# Altium schematic sheet input_vhall.SchDoc
size A3; Organization: Altium Limited; Address1: L3, 12a Rodborough Rd; Address2: Frenchs Forest; Address3: NSW; Address4: Australia 2086
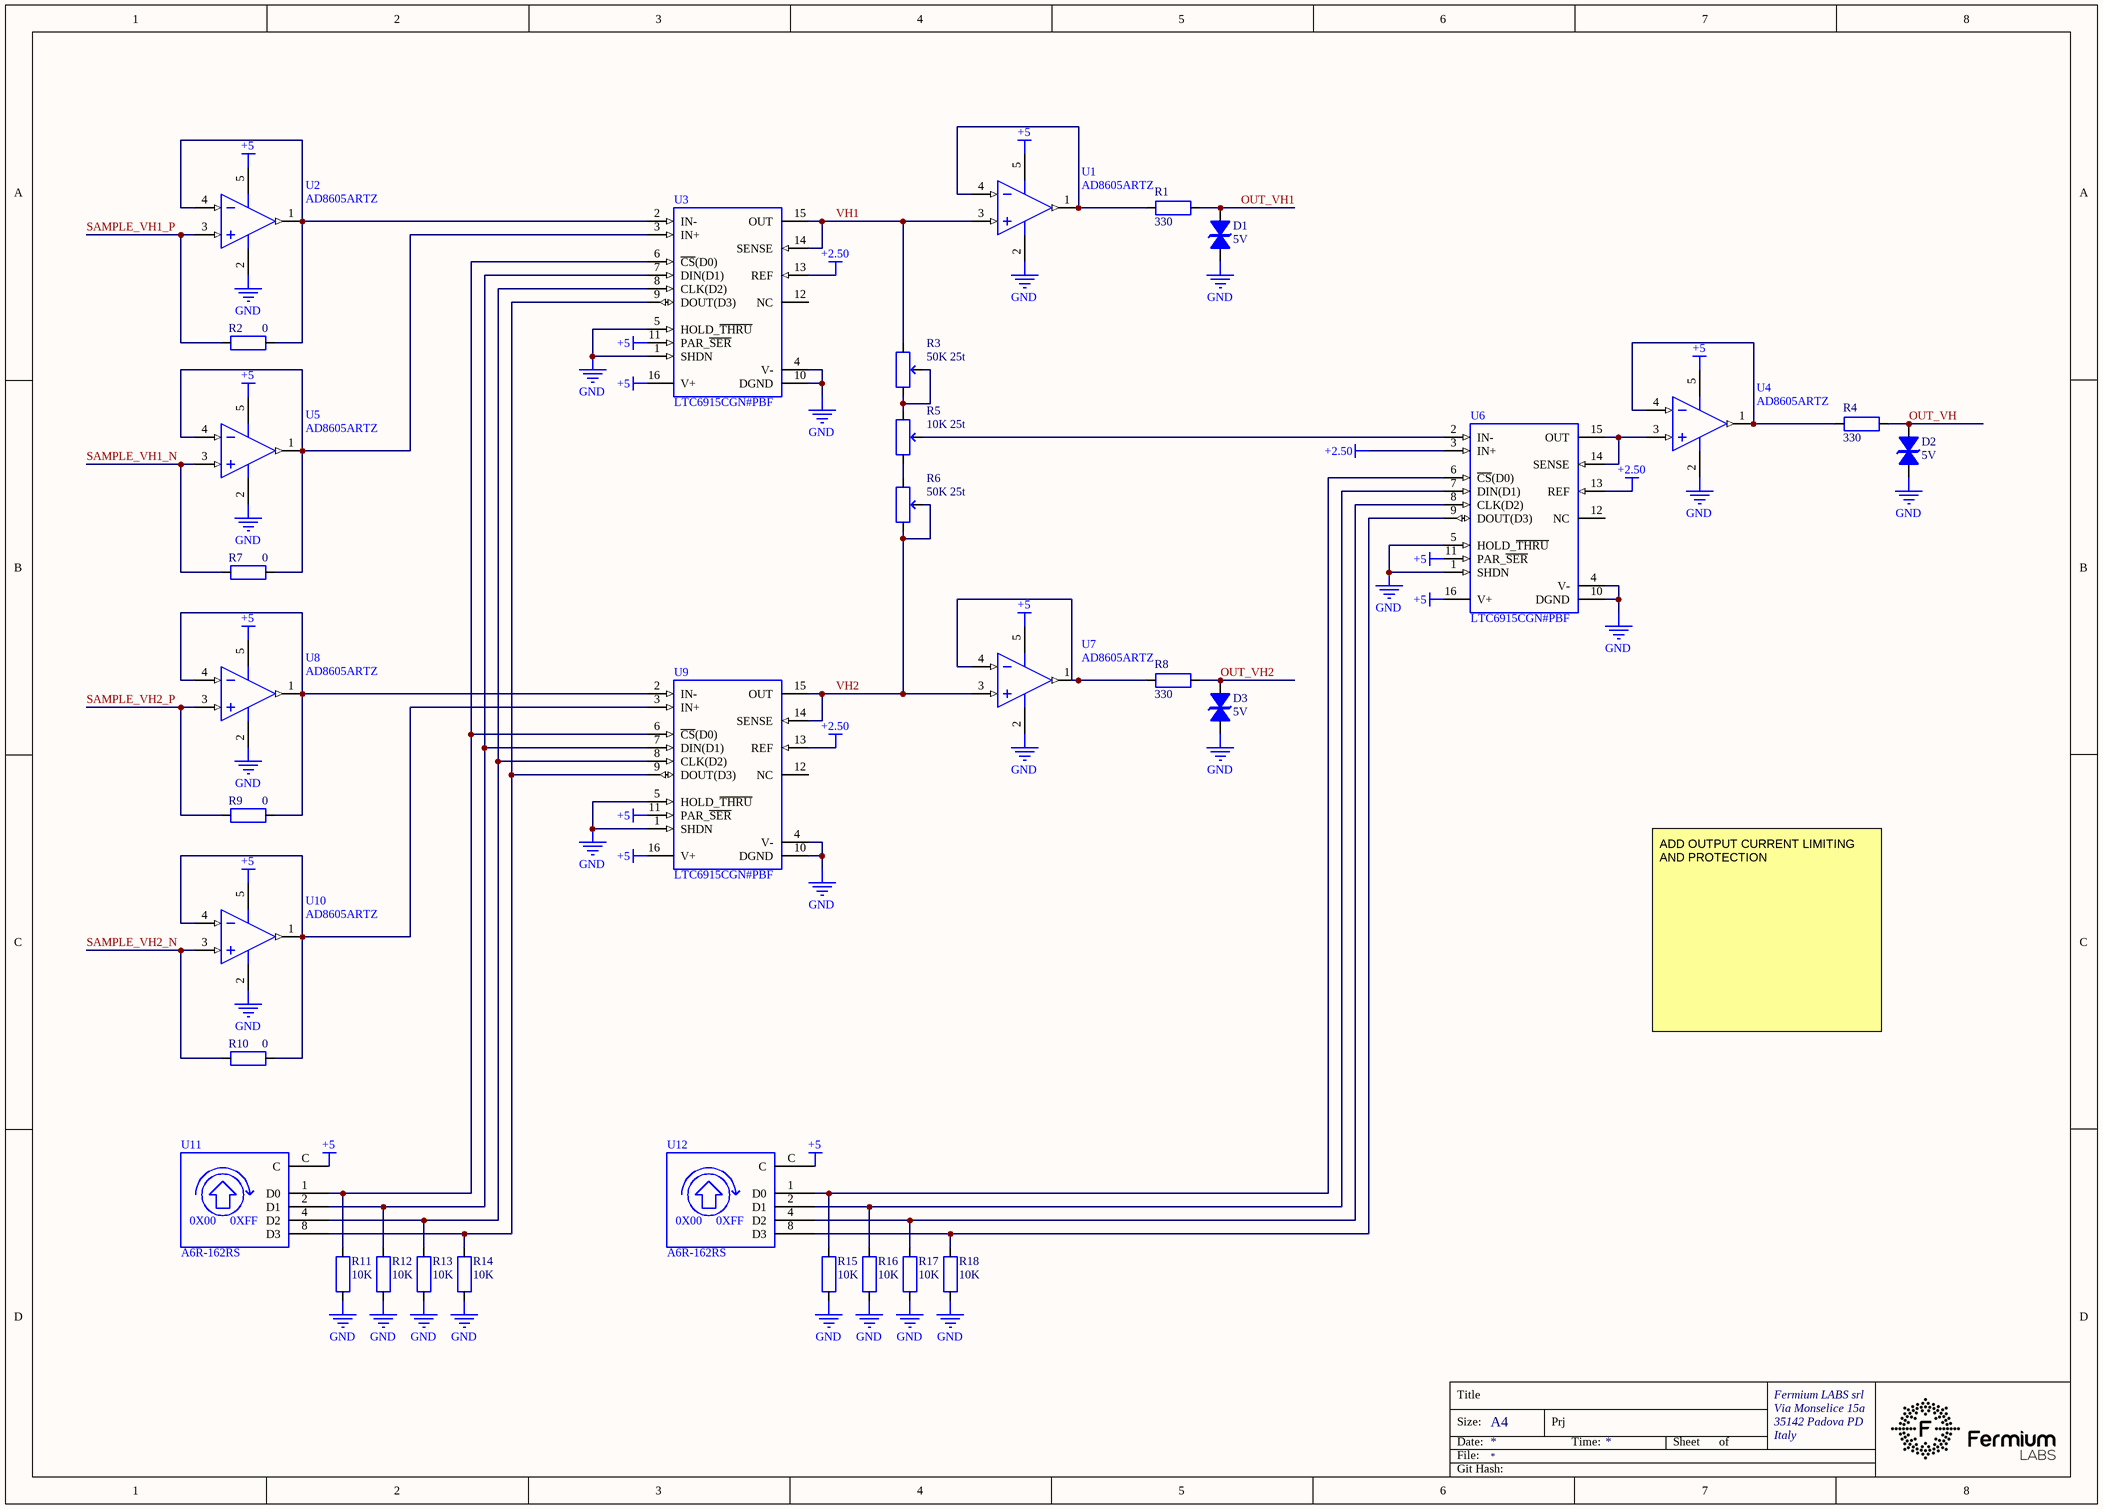
[diagram p0: input_vhall.SchDoc]

## Parts
D1  5V  [SOD523F]
D2  5V  [SOD523F]
D3  5V  [SOD523F]
R1  330
R2  0  [RES 0603_1608]
R3  50K 25t  [F9540903-09ED-4909-856A-DED10E64451E]
R4  330
R5  10K 25t  [F9540903-09ED-4909-856A-DED10E64451E]
R6  50K 25t  [F9540903-09ED-4909-856A-DED10E64451E]
R7  0  [RES 0603_1608]
R8  330
R9  0  [RES 0603_1608]
R10  0  [RES 0603_1608]
R11  10K  [RES 0603_1608]
R12  10K  [RES 0603_1608]
R13  10K  [RES 0603_1608]
R14  10K  [RES 0603_1608]
R15  10K  [RES 0603_1608]
R16  10K  [RES 0603_1608]
R17  10K  [RES 0603_1608]
R18  10K  [RES 0603_1608]
U1  AD8605ARTZ  [A3DDA0BC-073E-4B18-9613-F713A7EC1E27]
U2  AD8605ARTZ  [A3DDA0BC-073E-4B18-9613-F713A7EC1E27]
U3  LTC6915CGN#PBF  [517EE8A2-9FD8-4174-996D-BDBF76CA3EEB]
U4  AD8605ARTZ  [A3DDA0BC-073E-4B18-9613-F713A7EC1E27]
U5  AD8605ARTZ  [A3DDA0BC-073E-4B18-9613-F713A7EC1E27]
U6  LTC6915CGN#PBF  [517EE8A2-9FD8-4174-996D-BDBF76CA3EEB]
U7  AD8605ARTZ  [A3DDA0BC-073E-4B18-9613-F713A7EC1E27]
U8  AD8605ARTZ  [A3DDA0BC-073E-4B18-9613-F713A7EC1E27]
U9  LTC6915CGN#PBF  [517EE8A2-9FD8-4174-996D-BDBF76CA3EEB]
U10  AD8605ARTZ  [A3DDA0BC-073E-4B18-9613-F713A7EC1E27]
U11  A6R-162RS  [2599C238-5645-4A8C-8BF9-C7515FACCFA0]
U12  A6R-162RS  [2599C238-5645-4A8C-8BF9-C7515FACCFA0]

## Nets
+2.50: U3.13(REF) U6.3(IN+) U6.13(REF) U9.13(REF)
+5: U1.5(+V) U2.5(+V) U3.11(PAR_~{SER}) U3.16(V+) U4.5(+V) U5.5(+V) U6.11(PAR_~{SER}) U6.16(V+) U7.5(+V) U8.5(+V) U9.11(PAR_~{SER}) U9.16(V+) U10.5(+V) U11.C U12.C
GND: D1.2 D2.2 D3.2 R11.1 R12.1 R13.1 R14.1 R15.1 R16.1 R17.1 R18.1 U1.2(-V) U2.2(-V) U3.1(SHDN) U3.4(V-) U3.5(HOLD_~{THRU}) U3.10(DGND) U4.2(-V) U5.2(-V) U6.1(SHDN) U6.4(V-) U6.5(HOLD_~{THRU}) U6.10(DGND) U7.2(-V) U8.2(-V) U9.1(SHDN) U9.4(V-) U9.5(HOLD_~{THRU}) U9.10(DGND) U10.2(-V)
OUT_VH: D2.1 R4.2
OUT_VH1: D1.1 R1.2
OUT_VH2: D3.1 R8.2
SAMPLE_VH1_N: R7.1 U5.3(+IN)
SAMPLE_VH1_P: R2.1 U2.3(+IN)
SAMPLE_VH2_N: R10.1 U10.3(+IN)
SAMPLE_VH2_P: R9.1 U8.3(+IN)
VH1: R3.1 U1.3(+IN) U3.14(SENSE) U3.15(OUT)
VH2: R6.2 R6.3 U7.3(+IN) U9.14(SENSE) U9.15(OUT)
NetR1_1: R1.1 U1.1(OUT) U1.4(-IN)
NetR2_2: R2.2 U2.1(OUT) U2.4(-IN) U3.2(IN-)
NetR3_2: R3.2 R3.3 R5.3
NetR4_1: R4.1 U4.1(OUT) U4.4(-IN)
NetR5_1: R5.1 R6.1
NetR5_2: R5.2 U6.2(IN-)
NetR7_2: R7.2 U3.3(IN+) U5.1(OUT) U5.4(-IN)
NetR8_1: R8.1 U7.1(OUT) U7.4(-IN)
NetR9_2: R9.2 U8.1(OUT) U8.4(-IN) U9.2(IN-)
NetR10_2: R10.2 U9.3(IN+) U10.1(OUT) U10.4(-IN)
NetR11_2: R11.2 U3.6(~{CS}(D0)) U9.6(~{CS}(D0)) U11.1(D0)
NetR12_2: R12.2 U3.7(DIN(D1)) U9.7(DIN(D1)) U11.2(D1)
NetR13_2: R13.2 U3.8(CLK(D2)) U9.8(CLK(D2)) U11.4(D2)
NetR14_2: R14.2 U3.9(DOUT(D3)) U9.9(DOUT(D3)) U11.8(D3)
NetR15_2: R15.2 U6.6(~{CS}(D0)) U12.1(D0)
NetR16_2: R16.2 U6.7(DIN(D1)) U12.2(D1)
NetR17_2: R17.2 U6.8(CLK(D2)) U12.4(D2)
NetR18_2: R18.2 U6.9(DOUT(D3)) U12.8(D3)
NetU4_3: U4.3(+IN) U6.14(SENSE) U6.15(OUT)

Not connected (* = marked no-connect by the designer): U3 12(NC); U6 12(NC); U9 12(NC)

## Notes on the sheet
- ADD OUTPUT CURRENT LIMITING AND PROTECTION
- Title
- Fermium LABS srl
- Size:
- Date:
- File:
- A4
- Prj
- Time:
- Sheet
- of
- Via Monselice 15a
- 35142 Padova PD
- Italy
- Git Hash:
- (in symbol bbf157ad-cd7a-4e82-97e3-d6a037590888) 0X00; 0XFF

## Library data of the parts
D1-D3 = daa58212-38e2-4326-a156-8e48058c46f1: DIODE SMD TVS 5V BIDIRECTIONAL SOD-523; Manufacturer 1: Born Semiconductor; Manufacturer Part Number 1: PESD5V0S1BBN; id: 14837; Part Number: daa58212-38e2-4326-a156-8e48058c46f1; ComponentLink1Description: Datasheet; ComponentLink1URL: http://localhost:8080/static/files/Nexperia-PESD5V0S1BB-115_C976402019-08-16_201905.624024.pdf?Nexperia-PESD5V0S1BB-115_C97640.pdf; ComponentLink2Description: Datasheet; ComponentLink2URL: http://localhost:8080/static/files/1901051701_Bourne-Semicon-Shenzhen-PESD5V0S1BBN_C3142642019-08-16_201911.992552.pdf?1901051701_Bourne-Semicon-Shenzhen-PESD5V0S1BBN_C314264.pdf; Manufacturer 2: Nexperia; Manufacturer Part Number 2: PESD5V0S1BB,115; Value: 5V
R1 R4 R8 = e8555d7b-eeda-4727-b2e1-550cdc03d819: RES SMD 330 OHM 1% 1/10W 0603; Manufacturer 1: Yageo; Manufacturer Part Number 1: RC0603FR-07330RL; id: 12350; Part Number: e8555d7b-eeda-4727-b2e1-550cdc03d819; Value: 330
R2 R7 R9 R10 = 6ae227f9-847f-4766-8522-e11a83531204: RES SMD 0 OHM 5% 1/10W 0603; Manufacturer 1: Yageo; Manufacturer Part Number 1: RC0603JR-070RL; id: 11973; Part Number: 6ae227f9-847f-4766-8522-e11a83531204; Value: 0
R3 R6 = 90164141-8820-4471-9a6f-9a984ce9068c: POT TRIMMER LINEAR 50K 25TURNS VERT THT; Manufacturer 1: Bourns; Manufacturer Part Number 1: 3296W-1-503LF; id: 14849; Part Number: 90164141-8820-4471-9a6f-9a984ce9068c; ComponentLink1Description: Datasheet; ComponentLink1URL: http://localhost:8080/static/files/BOURNS-3296W-1-103LF_C34846_12019-08-17_221926.713297.pdf?BOURNS-3296W-1-103LF_C34846 (1).pdf; Value: 50K 25t
R5 = 613f65ed-4d8d-44d0-9fe5-67eff78392c9: POT TRIMMER LINEAR 10K 25TURNS VERT THT; Manufacturer 1: Bourns; Manufacturer Part Number 1: 3296W-1-103LF; id: 14847; Part Number: 613f65ed-4d8d-44d0-9fe5-67eff78392c9; ComponentLink1Description: 3D Model; ComponentLink1URL: http://localhost:8080/static/files/3296W_v12019-08-17_171307.552870.step?3296W v1.step; ComponentLink2Description: Datasheet; ComponentLink2URL: http://localhost:8080/static/files/BOURNS-3296W-1-103LF_C348462019-08-17_171320.734450.pdf?BOURNS-3296W-1-103LF_C34846.pdf; Value: 10K 25t
R11-R18 = 93242766-ba1d-462d-b58f-ce1dfc4129c8: RES SMD 10K OHM 1% 1/10W 0603; Manufacturer 1: Yageo; Manufacturer Part Number 1: RC0603FR-0710KL; id: 12101; Part Number: 93242766-ba1d-462d-b58f-ce1dfc4129c8; Value: 10K
U1 U2 U4 U5 U7 U8 U10 = 5610e9ea-bca8-49b2-8e5f-11409231f6a4: IC OPAMP 65uV 1pA RRIO 5V 80mA SOT-23-5; Manufacturer 1: Analog Devices; id: 14830; Part Number: 5610e9ea-bca8-49b2-8e5f-11409231f6a4; ComponentLink1Description: Datasheet; ComponentLink1URL: http://localhost:8080/static/files/Analog_Devices-AD8605ARTZ-REEL7-datasheet2019-08-16_175825.352099.pdf?Analog_Devices-AD8605ARTZ-REEL7-datasheet.pdf; Manufacturer Part Number 1: AD8605ARTZ
U3 U6 U9 = 59fe82cd-fd18-4813-9f52-e2e78a460aff: IC PGA G0-4094 SPI-PARALLEL 5V RRIO SSOP-16; Manufacturer 1: Analog Devices; id: 14835; Part Number: 59fe82cd-fd18-4813-9f52-e2e78a460aff; ComponentLink1Description: Datasheet; ComponentLink1URL: http://localhost:8080/static/files/Linear_Technology-LTC6915CDEPBF-datasheet2019-08-16_194420.284095.pdf?Linear_Technology-LTC6915CDE#PBF-datasheet.pdf; Manufacturer Part Number 1: LTC6915CGN#PBF
U11 U12 = bbf157ad-cd7a-4e82-97e3-d6a037590888: SWITCH ROTARY HEX/BCD 16 POSITIONS; Manufacturer 1: Omron; id: 14834; Part Number: bbf157ad-cd7a-4e82-97e3-d6a037590888; ComponentLink1Description: Datasheet; ComponentLink1URL: http://localhost:8080/static/files/A6R-A6RV2019-08-16_190638.241287.PDF?A6R-A6RV.PDF; ComponentLink2Description: 3D Model; ComponentLink2URL: http://localhost:8080/static/files/2599C238-5645-4A8C-8BF9-C7515FACCFA02019-08-16_192704.487115.step?2599C238-5645-4A8C-8BF9-C7515FACCFA0.step; Manufacturer Part Number 1: A6R-162RS